# Altium schematic sheet mainboard.SchDoc
size A2
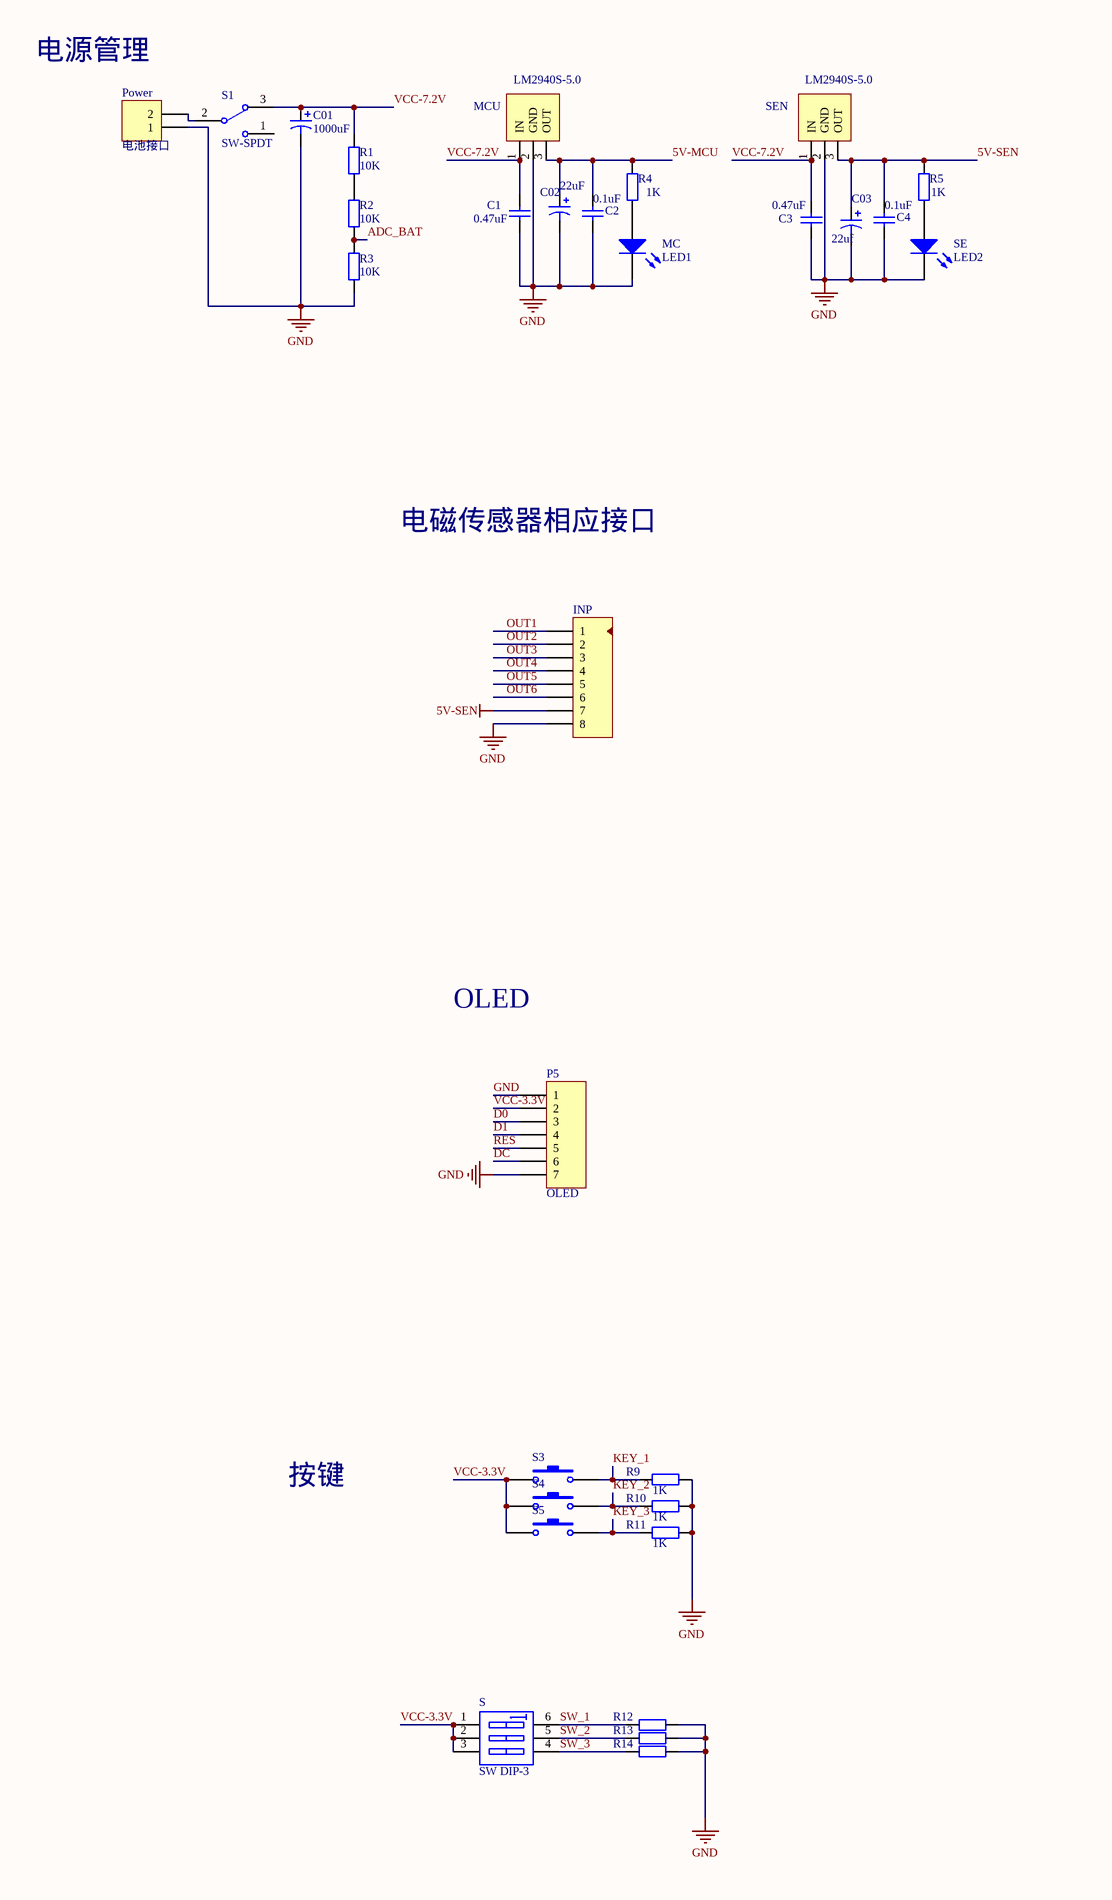
[diagram p0: mainboard.SchDoc, left]
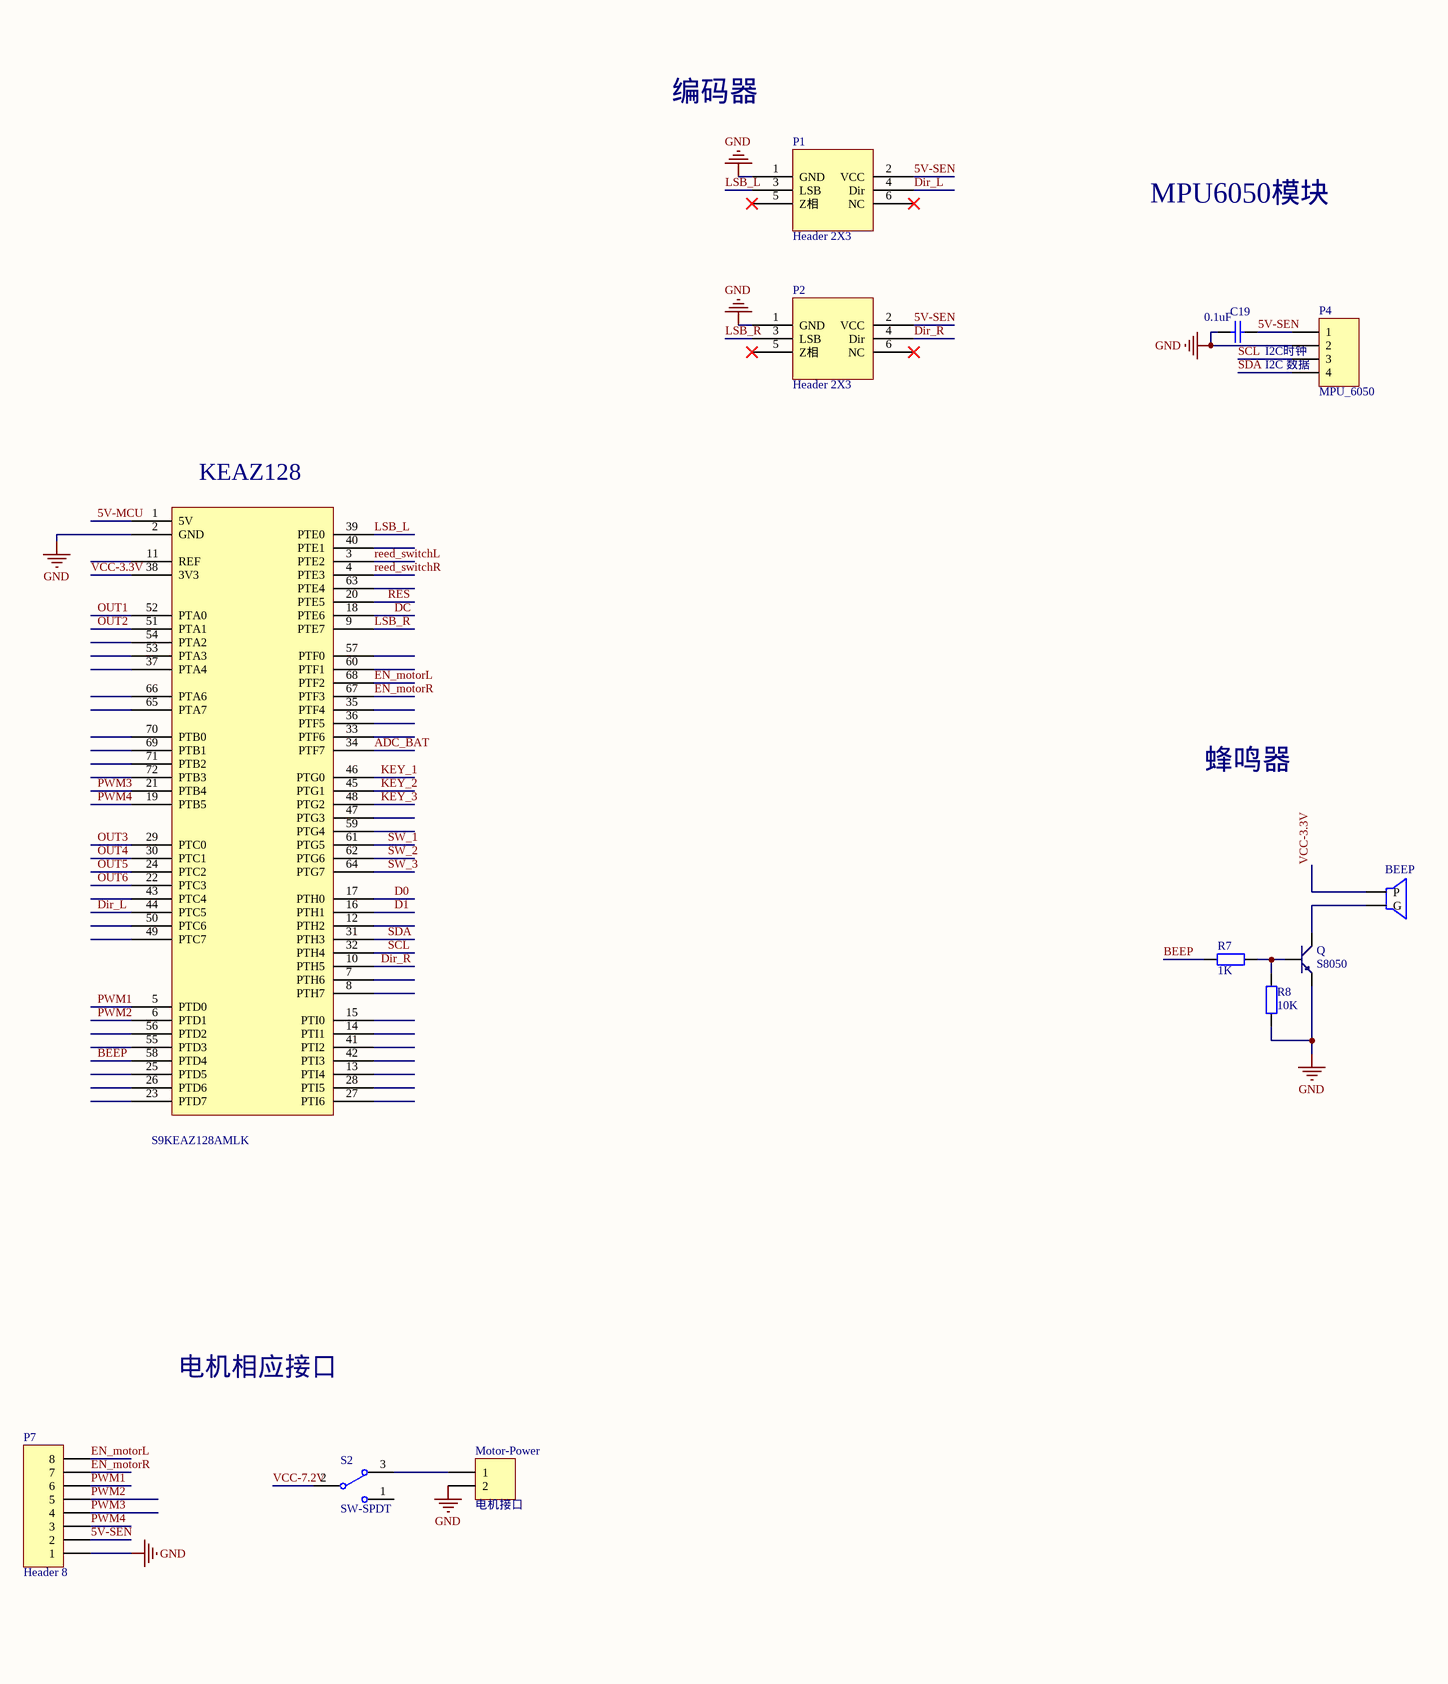
[diagram p1: mainboard.SchDoc, right]

## Parts
BEEP  (no value)  [PCBComponent_1]
C1  value 0.47uF  [0805]  (hidden comment: Cap)
C01  value 1000uF  [470uf 16V]  (hidden comment: Cap Pol1)
C2  value 0.1uF  [0805]  (hidden comment: Cap)
C02  value 22uF  [7343]  (hidden comment: Cap Pol1)
C03  value 22uf  [7343]  (hidden comment: Cap Pol2)
C3  value 0.47uF  [0805]  (hidden comment: Cap)
C4  value 0.1uF  [0805]  (hidden comment: Cap)
C19  value 0.1uF  [0805]  (hidden comment: Cap)
INP  (no value)  [HDR1X8]
KEAZ128  S9KEAZ128AMLK  [KEA128_CORE]
MC  LED1  [0805]
MCU  LM2940S-5.0  [TO-220]
Motor-Power  电机接口  [P_Header]
P1  Header 2X3  [HDR2X3]
P2  Header 2X3  [HDR2X3]
P4  MPU_6050  [HDR1X4]
P5  OLED  [HDR1X7]
P7  Header 8  [HDR1X8]
Power  电池接口  [P_Header]
Q  S8050  [TO-92]
R1  value 10K  [0805]  (hidden comment: Res2)
R2  value 10K  [0805]  (hidden comment: Res2)
R3  value 10K  [0805]  (hidden comment: Res2)
R4  value 1K  [0805]
R5  value 1K  [0805]
R7  value 1K  [0805]  (hidden comment: Res2)
R8  value 10K  [0805]  (hidden comment: Res2)
R9  value 1K  [0805]  (hidden comment: Res2)
R10  value 1K  [0805]  (hidden comment: Res2)
R11  value 1K  [0805]  (hidden comment: Res2)
R12  Res2  [0805]  (value not drawn)
R13  Res2  [0805]  (value not drawn)
R14  Res2  [0805]  (value not drawn)
S  SW DIP-3  [DIP-6]
S1  SW-SPDT  [Key_SWITCH]
S2  SW-SPDT  [Key_SWITCH]
S3  SW-PB  [轻触开关]  (value not drawn)
S4  SW-PB  [轻触开关]  (value not drawn)
S5  SW-PB  [轻触开关]  (value not drawn)
SE  LED2  [0805]
SEN  LM2940S-5.0  [TO-220]

## Nets
5V-SEN: C03.1 C4.2 C19.1 INP.7 P1.2(VCC) P2.2(VCC) P4.1 P7.2 R5.2 SEN.3(OUT)
GND: C1.1 C01.2 C2.1 C02.2 C3.1 C03.2 C4.1 C19.2 INP.8 KEAZ128.2(GND) MC.2(K) MCU.2(GND) Motor-Power.2 P1.1(GND) P2.1(GND) P4.2 P5.1 P5.7 P7.1 Power.1 Q.1(E) R3.1 R8.1 R9.1 R10.1 R11.1 R12.1 R13.1 R14.1 SE.2(K) SEN.2(GND)
5V-MCU: C02.1 C2.2 KEAZ128.1(5V) MCU.3(OUT) R4.2
ADC_BAT: KEAZ128.34(PTF7) R2.1 R3.2
BEEP: KEAZ128.58(PTD4) R7.2
D0: KEAZ128.17(PTH0) P5.3
D1: KEAZ128.16(PTH1) P5.4
DC: KEAZ128.18(PTE6) P5.6
Dir_L: KEAZ128.44(PTC5) P1.4(Dir)
Dir_R: KEAZ128.10(PTH5) P2.4(Dir)
EN_motorL: KEAZ128.68(PTF2) P7.8
EN_motorR: KEAZ128.67(PTF3) P7.7
KEY_1: KEAZ128.46(PTG0) R9.2 S3.2
KEY_2: KEAZ128.45(PTG1) R10.2 S4.2
KEY_3: KEAZ128.48(PTG2) R11.2 S5.2
LSB_L: KEAZ128.39(PTE0) P1.3(LSB)
LSB_R: KEAZ128.9(PTE7) P2.3(LSB)
OUT1: INP.1 KEAZ128.52(PTA0)
OUT2: INP.2 KEAZ128.51(PTA1)
OUT3: INP.3 KEAZ128.29(PTC0)
OUT4: INP.4 KEAZ128.30(PTC1)
OUT5: INP.5 KEAZ128.24(PTC2)
OUT6: INP.6 KEAZ128.22(PTC3)
PWM1: KEAZ128.5(PTD0) P7.6
PWM2: KEAZ128.6(PTD1) P7.5
PWM3: KEAZ128.21(PTB4) P7.4
PWM4: KEAZ128.19(PTB5) P7.3
reed_switchL: KEAZ128.3(PTE2)
reed_switchR: KEAZ128.4(PTE3)
RES: KEAZ128.20(PTE5) P5.5
SCL: KEAZ128.32(PTH4) P4.3
SDA: KEAZ128.31(PTH3) P4.4
SW_1: KEAZ128.61(PTG5) R12.2 S.6(B1)
SW_2: KEAZ128.62(PTG6) R13.2 S.5(B2)
SW_3: KEAZ128.64(PTG7) R14.2 S.4(B3)
VCC-3.3V: BEEP.1(P) KEAZ128.38(3V3) P5.2 S.1(A1) S.2(A2) S.3(A3) S3.1 S4.1 S5.1
VCC-7.2V: C01.1 C1.2 C3.2 MCU.1(IN) R1.2 S1.3 S2.2 SEN.1(IN)
NetBEEP_2: BEEP.2(G) Q.3(C)
NetMC_1: MC.1(A) R4.1
NetMotor-Power_1: Motor-Power.1 S2.3
NetPower_2: Power.2 S1.2
NetQ_2: Q.2(B) R7.1 R8.2
NetR1_1: R1.1 R2.2
NetR5_1: R5.1 SE.1(A)

Not connected (* = marked no-connect by the designer): KEAZ128 7(PTH6) 8(PTH7) 11(REF) 12(PTH2) 13(PTI4) 14(PTI1) 15(PTI0) 23(PTD7) 25(PTD5) 26(PTD6) 27(PTI6) 28(PTI5) 33(PTF6) 35(PTF4) 36(PTF5) 37(PTA4) 40(PTE1) 41(PTI2) 42(PTI3) 43(PTC4) 47(PTG3) 49(PTC7) 50(PTC6) 53(PTA3) 54(PTA2) 55(PTD3) 56(PTD2) 57(PTF0) 59(PTG4) 60(PTF1) 63(PTE4) 65(PTA7) 66(PTA6) 69(PTB1) 70(PTB0) 71(PTB2) 72(PTB3); P1 5(Z相)* 6(NC)*; P2 5(Z相)* 6(NC)*; S1 1; S2 1

## Notes on the sheet
- 电源管理
- 编码器
- MPU6050模块
- I2C时钟
- (near P4) I2C 数据
- 电磁传感器相应接口
- 蜂鸣器
- OLED
- 电机相应接口
- 按键

## Library data of the parts
BEEP = BEEP
C1-C4 C19 = Cap: Capacitor; Published: 8-Jun-2000; LatestRevisionDate: 17-Jul-2002; LatestRevisionNote: Re-released for DXP Platform.; PackageReference: RAD-0.3; Publisher: Altium Limited; PackageDescription: Radial Cap, Thru-Hole; 2 Leads; 0.3 in Pin Spacing
C01 C02 = Cap Pol1: Polarized Capacitor (Radial); Published: 8-Jun-2000; LatestRevisionDate: 17-Jul-2002; LatestRevisionNote: Re-released for DXP Platform.; PackageReference: RB7.6-15; Publisher: Altium Limited; PackageDescription: Polarized Capacitor (Radial); 2 Leads
C03 = Cap Pol2: Polarized Capacitor (Axial); Published: 8-Jun-2000; LatestRevisionDate: 17-Jul-2002; LatestRevisionNote: Re-released for DXP Platform.; PackageReference: POLAR0.8; Publisher: Altium Limited
INP = Header 8: 接插件; LatestRevisionDate: 17-Jul-2002; LatestRevisionNote: Re-released for DXP Platform.; Publisher: Altium Limited
KEAZ128 = KEA128-Core
MC SE = LED0: Typical INFRARED GaAs LED; Published: 8-Jun-2000; LatestRevisionDate: 08-Jul-2005; LatestRevisionNote: Mech Layer 1 removed.; PackageReference: LED-0; Publisher: Altium Limited; PackageDescription: LED; 2 Leads
MCU SEN = LM2940
Motor-Power Power = Header 2: Header, 2-Pin; LatestRevisionDate: 17-Jul-2002; LatestRevisionNote: Re-released for DXP Platform.; Publisher: Altium Limited
P1 P2 = 编码器
P4 = Header 4: Header, 4-Pin; LatestRevisionDate: 17-Jul-2002; LatestRevisionNote: Re-released for DXP Platform.; Publisher: Altium Limited
P5 = Header 7: Header, 7-Pin; LatestRevisionDate: 17-Jul-2002; LatestRevisionNote: Re-released for DXP Platform.; Publisher: Altium Limited
P7 = Header 8: Header, 8-Pin; LatestRevisionDate: 17-Jul-2002; LatestRevisionNote: Re-released for DXP Platform.; Publisher: Altium Limited
Q = NPN: 8050/BCW846/BCW847
R1-R5 R7-R14 = Res2: Resistor; Published: 8-Jun-2000; LatestRevisionDate: 17-Jul-2002; LatestRevisionNote: Re-released for DXP Platform.; PackageReference: AXIAL-0.4
  R1-R3 R7-R11: Publisher: Altium Limited
  R4 R5: Publisher: Altium Limited; PackageDescription: Axial Device, Thru-Hole; 2 Leads; 0.4 in Pin Spacing
  R12-R14: Publisher: 1K
S = SW DIP-3: DIP Switch, 3 Position, SPST; Published: 24-Mar-1999; LatestRevisionDate: 17-Jul-2002; LatestRevisionNote: Re-released for DXP Platform.; PackageReference: DIP-6; Publisher: Altium Limited; Code_JEDEC: MO-001-AM
S1 S2 = SW-SPDT: SPDT Subminiature Toggle Switch, Right Angle Mounting, Vertical Actuation; Published: 24-Mar-1999; LatestRevisionDate: 17-Dec-2003; LatestRevisionNote: Schematic revised, PCB Footprint replaced.; DatasheetDocument: 05-Dec-2000; PackageReference: TL36WW15050; Publisher: Altium Limited; ComponentLink1Description: Manufacturer Link; ComponentLink1URL: http://www.apem.com
S3-S5 = SW-PB: Switch; Published: 24-Mar-1999; LatestRevisionDate: 17-Jul-2002; LatestRevisionNote: Re-released for DXP Platform.; PackageReference: SPST-2; Publisher: Altium Limited